# Altium schematic sheet LDO.SchDoc: =DocumentName
size A4; CompanyName: "AS Manufacturing" LLC; Organization: "AS Manufacturing" LLC; Address1: 5 Sklyarenka St.; Address2: Kyiv 04073; Address3: Ukraine; Address4: https://ajax.systems/en/; SheetNumber: 4; SheetTotal: 5; Template_version: 1.0.1
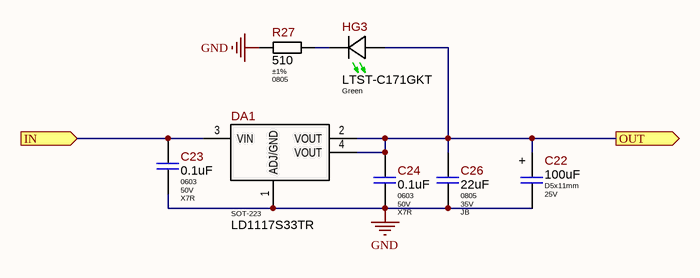
[diagram p0: LDO.SchDoc]

## Parts
C22  value 100uF  Package: D5x11mm  Voltage: 25V  [CAP-AE-PTH-50D05x110H15]  (hidden comment: 100uFx25V)
C23  Package: 0603  Voltage: 50V  Dielectric Type: X7R  [C_CERAMIC_0603_MED]  (hidden comment: 0.1uF)
C24  Package: 0603  Voltage: 50V  Dielectric Type: X7R  [C_CERAMIC_0603_MED]  (hidden comment: 0.1uF)
C26  Package: 0805  Voltage: 35V  Dielectric Type: JB  [CAP-0805(2012)X125T20]  (hidden comment: 22uF)
DA1  LD1117S33TR  [SOT-223]
HG3  Color: Green  [LTST-C171GKT]  (hidden comment: LTST-C171GKT)
R27  Tolerance: ±1%  Package: 0805  [R_ANY_CHIP_0805_MED]  (hidden comment: 510)

## Ports
IN (in), OUT (out)

## Nets
GND: C22.2 C23.1 C24.1 C26.2 DA1.1(ADJ/GND) R27.2
IN: C23.2 DA1.3(VIN) ; port IN
OUT: C22.1 C24.2 C26.1 DA1.2(VOUT) DA1.4(VOUT) HG3.AN(Anode) ; port OUT
NetHG3_CA: HG3.CA(Cathode) R27.1

## Notes on the sheet
- Title
- Product:
- Project:
- Size:
- Date:
- Variant:
- A4
- Authors:
- Time:
- Sheet
- of
- Revision:
- @Vitech_ua
- Commit:
- (in symbol KRM-025V101MC110-T/A2) +

## Library data of the parts
C22 = KRM-025V101MC110-T/A2: 100uF 25V ±20% D5x11mm 105℃ Aluminum Electrolytic Capacitor; Manufacturer: Koshin; Ajax_1C_ID: 55676; Ajax_1C_PN: 100uF 25V 20% 5x11mm KRM-025V101MC110-T/A2 Koshin Capacitors SMD RoHS; Ajax_1С_Status: RND Only; Standard Lead Time: NONE; Component Status: Released; GUID_1C: cc76a443-6c07-11ed-a366-005056994834; Part Number: KRM-025V101MC110-T/A2; Part Type: Aluminum; Component Type: PTH; Temperature Range: -40°C ~ 105°C; Tolerance: ±20%; Dielectric Type: NONE; ComponentLink1URL: \\altiumdb.ajax.local\files\Datasheet\Capacitor\Koshin - KRM Series.pdf; Replacement: NONE; Price: 0; ComponentLink1Description: Datasheet
C23 C24 = CL10B104KB8NNND: 100nF 50V X7R ±10% 0603 Ceramic Capacitor RoHS; Manufacturer: Samsung Electro-Mechanics; Ajax_1C_ID: 21313; Ajax_1C_PN: 100nF 50V X7R 10% 0603 CL10B104KB8NNND ceramic capacitor SMD; Ajax_1С_Status: Substitution; Standard Lead Time: 18 Weeks; Component Status: Released; Replacement: CL10B104KB8NNNC; GUID_1C: f1fd6399-ca68-11ea-ab63-0050569f2651; Value: 0.1uF; Part Number: CL10B104KB8NNND; Part Type: Ceramic / X7R / 0603; Component Type: SMD; Temperature Range: -55°C ~ 125°C; Tolerance: ±10%; ComponentLink1URL: https://media.digikey.com/pdf/Data%20Sheets/Samsung%20PDFs/CL_Series_MLCC_ds.pdf; Supplier 1: Digi-Key; Supplier Part Number 1: CL10B104KB8NNND-ND; Price: 0,0039378; ComponentLink1Description: Datasheet
C26 = C2012JB1V226M125AC: 22uF 35V JB ±20% 0805 Ceramic Capacitor RoHS; Manufacturer: TDK Corporation; Ajax_1C_ID: 32073; Ajax_1C_PN: 22uF 35V 20% 0805 TDK C2012JB1V226M125AC Ceramic Capacitors RoHS; Ajax_1С_Status: RND Only; Standard Lead Time: 30 Weeks; Component Status: Released; Replacement: NONE; GUID_1C: 562d6396-e930-11eb-ab74-0050569f2651; Value: 22uF; Part Number: C2012JB1V226M125AC; Part Type: Ceramic / JB / 0805; Component Type: SMD; Temperature Range: -25°C ~ 85°C; Tolerance: ±20%; ComponentLink1URL: https://product.tdk.com/info/en/catalog/datasheets/mlcc_commercial_general_en.pdf; Supplier 1: Mouser; Supplier Part Number 1: 810-C2012JB1V226M12C; Price: 0,567; ComponentLink1Description: Datasheet
DA1 = LD1117S33TR: Adjustable and fixed low drop positive voltage regulator, 3.3V 800mA, 1.25V to 15V Vin; Manufacturer: STMicroelectronics; Ajax_1C_ID: 1306; Ajax_1C_PN: LD1117S33TR LDO voltage regulators; Ajax_1С_Status: Mass Production; Standard Lead Time: 10 Weeks; Component Status: Released; Replacement: NONE; GUID_1C: 8fe842de-dd43-11e0-af93-6c626deda1bb; Package: SOT-223; Part Number: LD1117S33TR; Part Type: Power / Linear Regulator; Component Type: SMD; Temperature Range: 0°C ~ 125°C; ComponentLink1URL: https://www.st.com/content/ccc/resource/technical/document/datasheet/99/3b/7d/91/91/51/4b/be/CD00000544.pdf/files/CD00000544.pdf/jcr:content/translations/en.CD00000544.pdf; Supplier 1: Digi-Key; Supplier Part Number 1: 497-1242-2-ND; Price: 0,103; ComponentLink1Description: Datasheet
HG3 = LTST-C171GKT: Low Power LED, Green 565nm, Clear, SMD 0805, Vf 2.1V - 2.6V, 5 ~ 12mcd @ 20 mA, 130°; Manufacturer: Lite-On Optoelectronics; Ajax_1C_ID: 30364; Ajax_1C_PN: LTST-C171GKT Green SMD LED 0805 12mcd 20mA 130deg RoHS; Ajax_1С_Status: RND Only; Component Status: Released; Replacement: NONE; GUID_1C: df39881f-c399-11eb-ab74-0050569f2651; Part Number: LTST-C171GKT; Part Type: LED / 0805; Component Type: SMD; Package: 0805; Wavelength: 565nm; Temperature Range: -55°C ~ 85°C; ComponentLink1URL: https://media.digikey.com/pdf/Data%20Sheets/Lite-On%20PDFs/LTST-C171GKT.pdf; Supplier 1: Digi-Key; Supplier Part Number 1: 160-1423-2-ND; Price: 0,0319; ComponentLink1Description: Datasheet
R27 = ERJ-P06F5100V: 510 Ohms ±1%, 1/2W 0805 High Power Thick Film Resistor; Manufacturer: Panasonic; Ajax_1C_ID: 15765; Ajax_1C_PN: 510R 1% 0.5W 0805 Panasonic ERJ-P06F5100V Resistors SMD RoHS; Ajax_1С_Status: RND Only; Power Rating: 0.5W; Voltage: 400V; Component Status: Released; Temperature Stability: ±100ppm/°C; Replacement: NONE; GUID_1C: 3592f296-62b5-11e9-ab4f-0050569f2651; Value: 510; Part Number: ERJ-P06F5100V; Component Type: SMD; Part Type: Thick Film / Anti-Surge/Pulse Withstanding; Temperature Range: -55°C ~ 155°C; ComponentLink1URL: https://eu.mouser.com/datasheet/2/315/AOA0000C331-1141874.pdf; Supplier 1: Mouser; Supplier Part Number 1: 667-ERJ-P06F5100V; Price: 0,036096; ComponentLink1Description: Datasheet